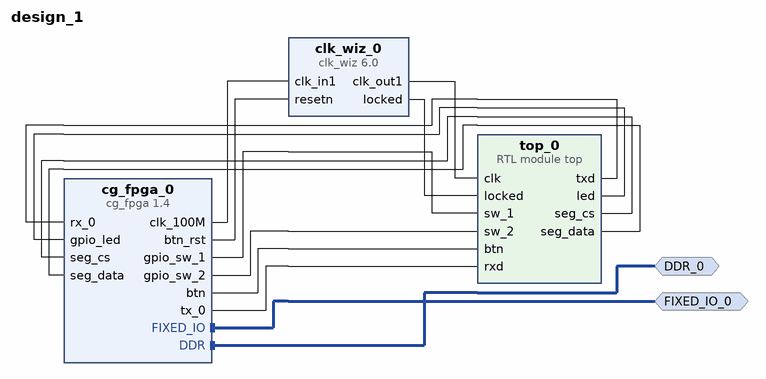
[diagram p0: block diagram of the top level]
# Vivado block design design_1, xc7z020clg400-1, Vivado 2018.3
create_bd_design design_1

create_bd_intf_port -mode Master -vlnv xilinx.com:interface:ddrx_rtl:1.0 DDR_0
create_bd_intf_port -mode Master -vlnv xilinx.com:display_processing_system7:fixedio_rtl:1.0 FIXED_IO_0

create_bd_cell -type ip -vlnv educg.net:user:cg_fpga:1.4 cg_fpga_0
create_bd_cell -type ip -vlnv xilinx.com:ip:clk_wiz:6.0 clk_wiz_0
set_property -dict [list \
  CONFIG.CLKOUT1_JITTER 151.636 \
  CONFIG.CLKOUT1_REQUESTED_OUT_FREQ 50 \
  CONFIG.MMCM_CLKOUT0_DIVIDE_F 20.000 \
  CONFIG.MMCM_DIVCLK_DIVIDE 1 \
  CONFIG.RESET_PORT resetn \
  CONFIG.RESET_TYPE ACTIVE_LOW \
] [get_bd_cells clk_wiz_0]
create_bd_cell -type module -reference top top_0

# ---- connections ----

connect_bd_intf_net [get_bd_intf_ports FIXED_IO_0] [get_bd_intf_pins cg_fpga_0/FIXED_IO]
connect_bd_intf_net [get_bd_intf_ports DDR_0] [get_bd_intf_pins cg_fpga_0/DDR]
connect_bd_net [get_bd_pins clk_wiz_0/clk_out1] [get_bd_pins top_0/clk]
connect_bd_net [get_bd_pins clk_wiz_0/locked] [get_bd_pins top_0/locked]
connect_bd_net [get_bd_pins cg_fpga_0/clk_100M] [get_bd_pins clk_wiz_0/clk_in1]
connect_bd_net [get_bd_pins cg_fpga_0/gpio_sw_1] [get_bd_pins top_0/sw_1]
connect_bd_net [get_bd_pins cg_fpga_0/gpio_sw_2] [get_bd_pins top_0/sw_2]
connect_bd_net [get_bd_pins cg_fpga_0/btn] [get_bd_pins top_0/btn]
connect_bd_net [get_bd_pins top_0/txd] [get_bd_pins cg_fpga_0/rx_0]
connect_bd_net [get_bd_pins top_0/led] [get_bd_pins cg_fpga_0/gpio_led]
connect_bd_net [get_bd_pins top_0/seg_cs] [get_bd_pins cg_fpga_0/seg_cs]
connect_bd_net [get_bd_pins top_0/seg_data] [get_bd_pins cg_fpga_0/seg_data]
connect_bd_net [get_bd_pins cg_fpga_0/btn_rst] [get_bd_pins clk_wiz_0/resetn]
connect_bd_net [get_bd_pins cg_fpga_0/tx_0] [get_bd_pins top_0/rxd]

validate_bd_design
save_bd_design
